# EAGLE design KeyboardLight (EAGLE 5.09)
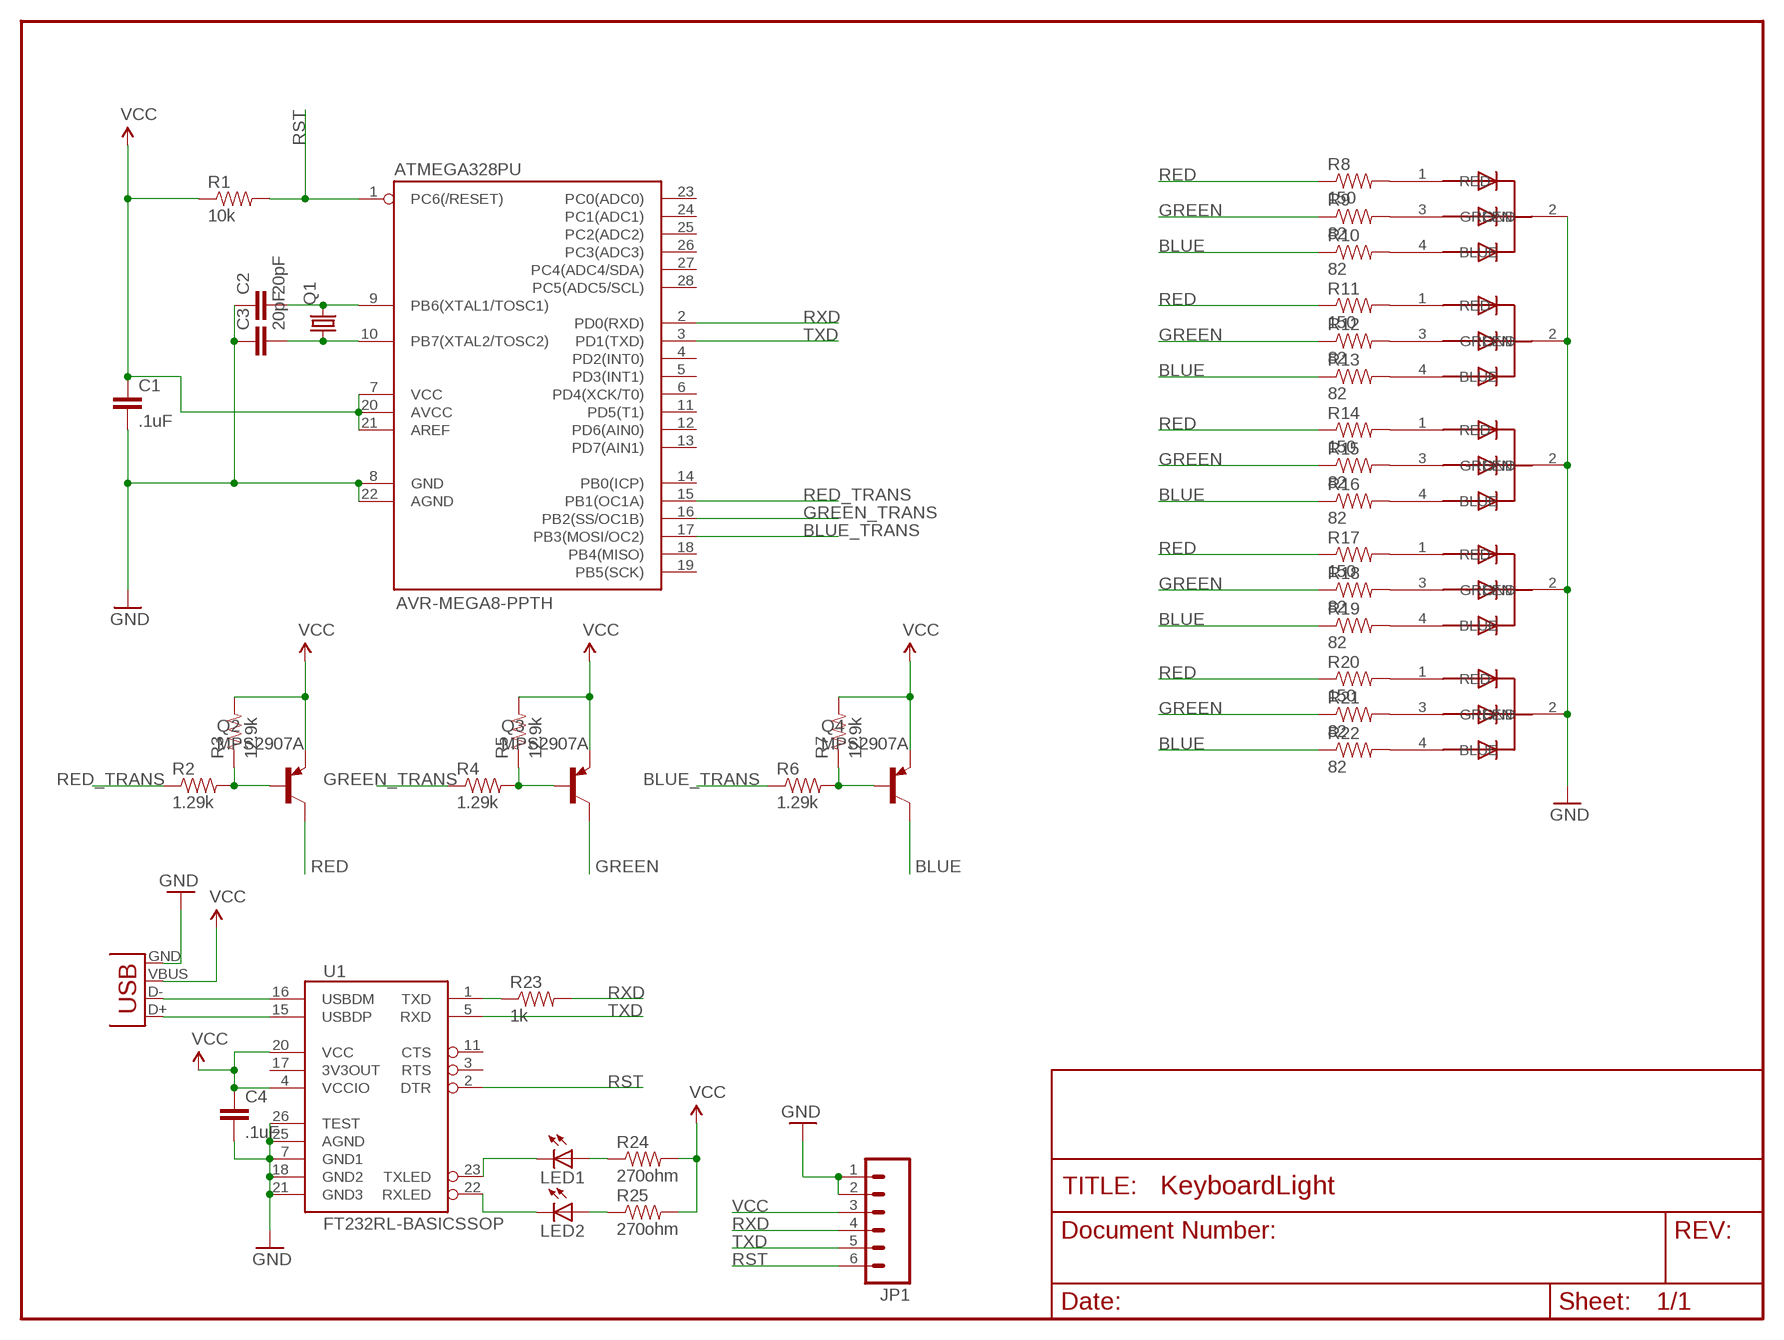
[diagram p0: schematic, sheet 1]

## Parts
ATMEGA328PU  AVR-MEGA8-PPTH  [DIL28-3]
C1  .1uF  CAPPTH  [CAP-PTH-SMALL]
C2  20pF  CAPPTH  [CAP-PTH-SMALL]
C3  20pF  CAPPTH  [CAP-PTH-SMALL]
C4  .1uF  CAPPTH  [CAP-PTH-SMALL]
JP1  M06LONGPADS  [1X06_LONGPADS]
LED1  LED0603  [LED-0603]
LED2  LED0603  [LED-0603]
Q1  CRYSTALHC49UV  [HC49U-V]
Q2  MPS2907A  [TO92-CBE]
Q3  MPS2907A  [TO92-CBE]
Q4  MPS2907A  [TO92-CBE]
R1  10k  RESISTORPTH1  [AXIAL-0.3]
R2  1.29k  RESISTORPTH1  [AXIAL-0.3]
R3  12.9k  RESISTORPTH1  [AXIAL-0.3]
R4  1.29k  RESISTORPTH1  [AXIAL-0.3]
R5  12.9k  RESISTORPTH1  [AXIAL-0.3]
R6  1.29k  RESISTORPTH1  [AXIAL-0.3]
R7  12.9k  RESISTORPTH1  [AXIAL-0.3]
R8  150  RESISTORPTH1  [AXIAL-0.3]
R9  82  RESISTORPTH1  [AXIAL-0.3]
R10  82  RESISTORPTH1  [AXIAL-0.3]
R11  150  RESISTORPTH1  [AXIAL-0.3]
R12  82  RESISTORPTH1  [AXIAL-0.3]
R13  82  RESISTORPTH1  [AXIAL-0.3]
R14  150  RESISTORPTH1  [AXIAL-0.3]
R15  82  RESISTORPTH1  [AXIAL-0.3]
R16  82  RESISTORPTH1  [AXIAL-0.3]
R17  150  RESISTORPTH1  [AXIAL-0.3]
R18  82  RESISTORPTH1  [AXIAL-0.3]
R19  82  RESISTORPTH1  [AXIAL-0.3]
R20  150  RESISTORPTH1  [AXIAL-0.3]
R21  82  RESISTORPTH1  [AXIAL-0.3]
R22  82  RESISTORPTH1  [AXIAL-0.3]
R23  1k  RESISTORPTH1  [AXIAL-0.3]
R24  270ohm  RESISTORPTH1  [AXIAL-0.3]
R25  270ohm  RESISTORPTH1  [AXIAL-0.3]
U1  FT232RL-BASICSSOP  [SSOP28DB]
U$1  RGBLED5MM_CC  [LEDRGB5MM]
U$2  RGBLED5MM_CC  [LEDRGB5MM]
U$3  RGBLED5MM_CC  [LEDRGB5MM]
U$4  RGBLED5MM_CC  [LEDRGB5MM]
U$5  RGBLED5MM_CC  [LEDRGB5MM]
U$6  MOTTO  [BECURIOUSMYSON]
X1  USBPTH  [USB-B-PTH]

## Nets
BLUE: Q4.C R10.P$1 R13.P$1 R16.P$1 R19.P$1 R22.P$1
BLUE_TRANS: ATMEGA328PU.17(PB3(MOSI/OC2)) R6.P$1
GND: ATMEGA328PU.8(GND) ATMEGA328PU.22(AGND) C1.2 C2.1 C3.1 C4.2 JP1.1 JP1.2 U1.7(GND1) U1.18(GND2) U1.21(GND3) U1.25(AGND) U1.26(TEST) U$1.2(GND) U$2.2(GND) U$3.2(GND) U$4.2(GND) U$5.2(GND) X1.GND
GREEN: Q3.C R9.P$1 R12.P$1 R15.P$1 R18.P$1 R21.P$1
GREEN_TRANS: ATMEGA328PU.16(PB2(SS/OC1B)) R4.P$1
N$1: ATMEGA328PU.9(PB6(XTAL1/TOSC1)) C2.2 Q1.2
N$2: ATMEGA328PU.10(PB7(XTAL2/TOSC2)) C3.2 Q1.1
N$3: U1.16(USBDM) X1.D-
N$4: Q2.B R2.P$2 R3.P$1
N$5: Q3.B R4.P$2 R5.P$1
N$6: Q4.B R6.P$2 R7.P$1
N$7: R8.P$2 U$1.1(RED)
N$8: R9.P$2 U$1.3(GREEN)
N$9: R10.P$2 U$1.4(BLUE)
N$10: R11.P$2 U$2.1(RED)
N$11: R12.P$2 U$2.3(GREEN)
N$12: R13.P$2 U$2.4(BLUE)
N$13: R14.P$2 U$3.1(RED)
N$14: R15.P$2 U$3.3(GREEN)
N$15: R16.P$2 U$3.4(BLUE)
N$16: R17.P$2 U$4.1(RED)
N$17: R18.P$2 U$4.3(GREEN)
N$18: R19.P$2 U$4.4(BLUE)
N$19: R20.P$2 U$5.1(RED)
N$20: R21.P$2 U$5.3(GREEN)
N$21: R22.P$2 U$5.4(BLUE)
N$22: U1.15(USBDP) X1.D+
N$23: LED1.A R24.P$1
N$24: R23.P$1 U1.1(TXD)
N$25: LED2.A R25.P$1
N$26: LED1.C U1.23(TXLED)
N$27: LED2.C U1.22(RXLED)
RED: Q2.C R8.P$1 R11.P$1 R14.P$1 R17.P$1 R20.P$1
RED_TRANS: ATMEGA328PU.15(PB1(OC1A)) R2.P$1
RST: ATMEGA328PU.1(PC6(/RESET)) JP1.6 R1.P$2 U1.2(DTR)
RXD: ATMEGA328PU.2(PD0(RXD)) JP1.4 R23.P$2
TXD: ATMEGA328PU.3(PD1(TXD)) JP1.5 U1.5(RXD)
VCC: ATMEGA328PU.7(VCC) ATMEGA328PU.20(AVCC) ATMEGA328PU.21(AREF) C1.1 C4.1 JP1.3 Q2.E Q3.E Q4.E R1.P$1 R3.P$2 R5.P$2 R7.P$2 R24.P$2 R25.P$2 U1.4(VCCIO) U1.20(VCC) X1.VBUS
Unconnected: ATMEGA328PU.4(PD2(INT0)) ATMEGA328PU.5(PD3(INT1)) ATMEGA328PU.6(PD4(XCK/T0)) ATMEGA328PU.11(PD5(T1)) ATMEGA328PU.12(PD6(AIN0)) ATMEGA328PU.13(PD7(AIN1)) ATMEGA328PU.14(PB0(ICP)) ATMEGA328PU.18(PB4(MISO)) ATMEGA328PU.19(PB5(SCK)) ATMEGA328PU.23(PC0(ADC0)) ATMEGA328PU.24(PC1(ADC1)) ATMEGA328PU.25(PC2(ADC2)) ATMEGA328PU.26(PC3(ADC3)) ATMEGA328PU.27(PC4(ADC4/SDA)) ATMEGA328PU.28(PC5(ADC5/SCL)) U1.3(RTS) U1.11(CTS) U1.17(3V3OUT)

## Library data of the parts
ATMEGA328PU = SparkFun:AVR-MEGA8-P: MICROCONTROLLER 8 Kbytes FLASH 1 kbytes SRAM 512 bytes EEPROM USART 4-channel 10 bit ADC 2-channel 8 bit ADC
C1-C4 = SparkFun:CAP: Capacitor Standard 0603 ceramic capacitor, and 0.1" leaded capacitor.
JP1 = SparkFun:M06: Header 6 Standard 6-pin 0.1" header. Use with straight break away headers (SKU : PRT-00116), right angle break away headers (PRT-00553), swiss pins (PRT-00743), machine pins (PRT-00117), and female headers (PRT-00115). Molex polarized connector foot print use with SKU : PRT-08094 with associated crimp pins and housings. NOTES ON THE VARIANTS LOCK and LOCK_LONGPADS... This footprint was designed to help hold the alignment of a through-hole component (i.e. 6-pin header) while soldering it into place. You may notice that each hole has been shifted either up or down by 0.005 of an inch from it's more standard position (which is a perfectly straight line). This slight alteration caused the pins (the squares in the middle) to touch the edges of the holes. Because they are alternating, it causes a "brace" to hold the component in place. 0.005 has proven to be the perfect amount of "off-center" position when using our standard breakaway headers. Although looks a little odd when you look at the bare footprint, once you have a header in there, the alteration is very hard to notice. Also, if you push a header all the way into place, it is covered up entirely on the bottom side. This idea of altering the position of holes to aid alignment will be further integrated into the Sparkfun Library for other footprints. It can help hold any component with 3 or more connection pins.
LED1 LED2 = SparkFun:LED: LEDs Standard schematic elements and footprints for 5mm, 3mm, 1206, and 0603 sized LEDs. 5mm - Spark Fun Electronics SKU : COM-00529 (and others)
Q1 = SparkFun:CRYSTAL: Crystals Various standard crystals. Proven footprints. Spark Fun Electronics SKU : COM-00534
Q2-Q4 = transistor-pnp:MPS2907*: PNP Transistror
R1-R25 = SparkFun:RESISTOR: Resistor Basic schematic elements and footprints for 0603, 1206, and PTH 1/10th watt (small) resistors.
U1 = SparkFun:FT232RL-BASIC: USB UART This is the simplified version of the FT232RL unit. Only what you need, nothing you don't. Spark Fun Electronics SKU : COM-00650
U$1-U$5 = jaycollett:RGBLED5MM_CC: 5MM RGB LED Common Cathode Suggested 150ohm for RED and 82ohm for Green and Blue
U$6 = jaycollett:MOTTO
X1 = SparkFun:USB: USB Connectors USB-B-PTH is fully proven SKU : PRT-00139 USB-miniB is fully proven SKU : PRT-00587 USB-A-PCB is untested. USB-A-H is throughly reviewed, but untested. Spark Fun Electronics SKU : PRT-00437 USB-B-SMT is throughly reviewed, but untested. Needs silkscreen touching up. USB-A-S has not been used/tested USB-MB-H has not been used/tested

## Board
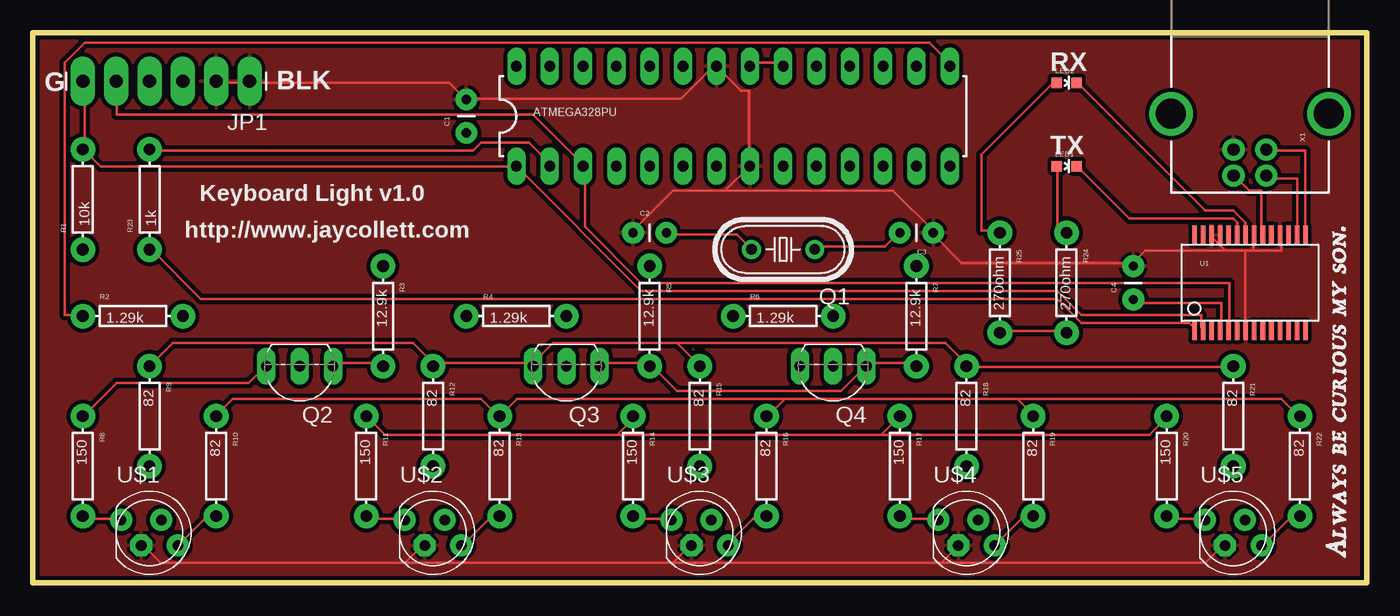
[diagram p1: board, top side]
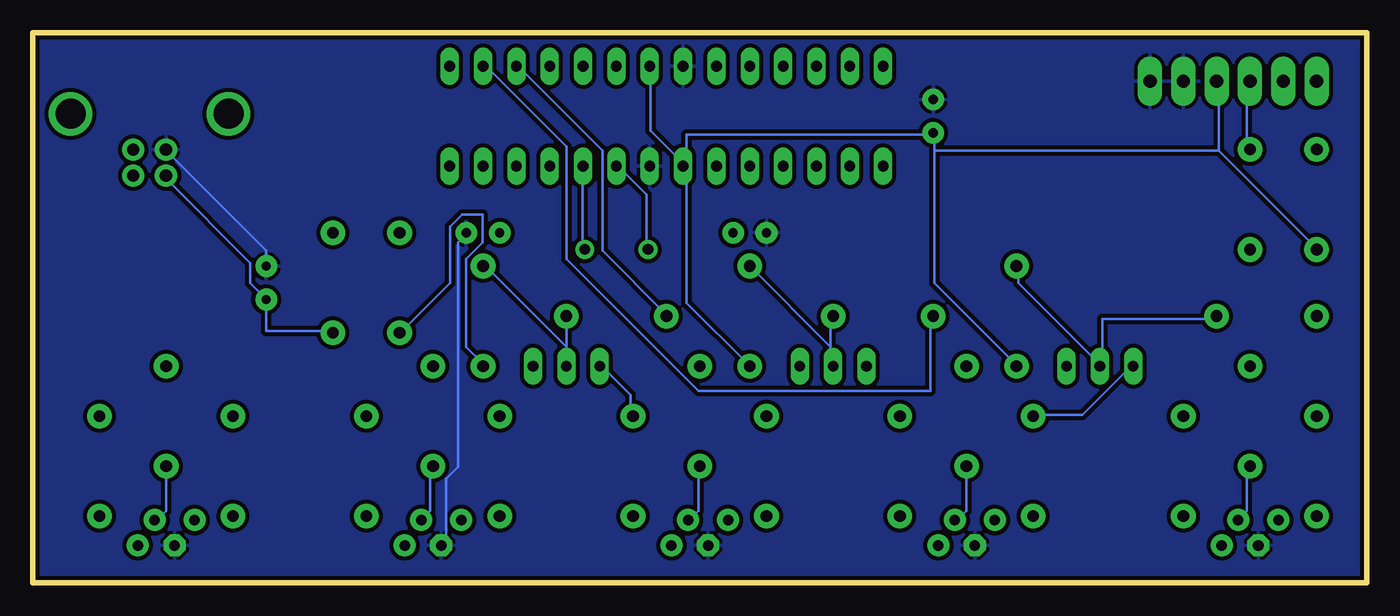
[diagram p2: board, bottom side, seen from below]

Size 101.6 x 41.91 mm. Coordinates in mm from the lower left corner, seen from the top.
Outline: 0,0 101.6,0 101.6,41.91 0,41.91 0,0
Copper layers (1*16): Top 0.035mm / dielectric 1.5mm / Bottom 0.035mm
Design rules "SparkFun": minimum track width 8mil, minimum drill 20mil, track to track 8mil, track to pad 8mil, pad to pad 8mil, via to via 8mil, smd to smd 8mil, copper to edge 10mil, drill to drill 8mil, minimum pad ring 12mil, minimum via ring 10mil, stop-mask expansion 4mil, vias tented up to drill 25mil, thermal gap 10mil

### Footprints (pad centres in the part's own frame; a part is rotated, then mirrored left to right if it is on the bottom)
DIL28-3 = drill 0.813 long: 1 -16.51,-3.81; 2 -13.97,-3.81; 3 -11.43,-3.81; 4 -8.89,-3.81; 5 -6.35,-3.81; 6 -3.81,-3.81; 7 -1.27,-3.81; 8 1.27,-3.81; 9 3.81,-3.81; 10 6.35,-3.81; 11 8.89,-3.81; 12 11.43,-3.81; 13 13.97,-3.81; 14 16.51,-3.81; 15 16.51,3.81; 16 13.97,3.81; 17 11.43,3.81; 18 8.89,3.81; 19 6.35,3.81; 20 3.81,3.81; 21 1.27,3.81; 22 -1.27,3.81; 23 -3.81,3.81; 24 -6.35,3.81; 25 -8.89,3.81; 26 -11.43,3.81; 27 -13.97,3.81; 28 -16.51,3.81
CAP-PTH-SMALL = drill 0.7 pad 1.651 round: 1 0,0; 2 2.54,0
1X06_LONGPADS = drill 1.016 pad 1.88 long: 1 0,0; 2 2.54,0; 3 5.08,0; 4 7.62,0; 5 10.16,0; 6 12.7,0
LED-0603 = smd 0.8 x 0.8: A 0,-0.75; C 0,0.75
HC49U-V = drill 0.813 round: 1 -2.413,0; 2 2.413,0
TO92-CBE = drill 0.813 long: B 0,0; C 2.54,0; E -2.54,0
AXIAL-0.3 = drill 0.9 pad 1.88 round: P$1 -3.81,0; P$2 3.81,0
SSOP28DB = smd 0.348 x 1.397: 1 -4.225,-3.656; 2 -3.575,-3.656; 3 -2.925,-3.656; 4 -2.275,-3.656; 5 -1.625,-3.656; 6 -0.975,-3.656; 7 -0.325,-3.656; 8 0.325,-3.656; 9 0.975,-3.656; 10 1.625,-3.656; 11 2.275,-3.656; 12 2.925,-3.656; 13 3.575,-3.656; 14 4.225,-3.656; 15 4.225,3.656; 16 3.575,3.656; 17 2.925,3.656; 18 2.275,3.656; 19 1.625,3.656; 20 0.975,3.656; 21 0.325,3.656; 22 -0.325,3.656; 23 -0.975,3.656; 24 -1.625,3.656; 25 -2.275,3.656; 26 -2.925,3.656; 27 -3.575,3.656; 28 -4.225,3.656
LEDRGB5MM = drill 0.8 pad 1.676 round: 1 -2.159,0.968; 3 0.889,0.968; 4 2.159,-0.968 | drill 0.8 pad 1.676 octagon: 2 -0.635,-0.968
USB-B-PTH = drill 0.914 pad 1.676 round: D+ 0,1.25; D- 1.981,1.25; GND 0,-1.25; VBUS 1.981,-1.25 | drill 2.286 round: P$1 -2.718,-6.02; P$2 -2.718,6.02

### Placement (x,y rotation side)
ATMEGA328PU  53.34,35.56 0 top
C1  33.02,34.29 90 top
C2  45.72,26.67 0 top
C3  68.58,26.67 180 top
C4  83.82,21.59 90 top
JP1  16.51,38.23 180 top
LED1  78.74,31.75 270 top
LED2  78.74,38.1 270 top
Q1  57.15,25.4 180 top
Q2  20.32,16.51 180 top
Q3  40.64,16.51 180 top
Q4  60.96,16.51 180 top
R1  3.81,29.21 90 top
R2  7.62,20.32 0 top
R3  26.67,20.32 270 top
R4  36.83,20.32 0 top
R5  46.99,20.32 270 top
R6  57.15,20.32 0 top
R7  67.31,20.32 270 top
R8  3.81,8.89 270 top
R9  8.89,12.7 270 top
R10  13.97,8.89 270 top
R11  25.4,8.89 270 top
R12  30.48,12.7 270 top
R13  35.56,8.89 270 top
R14  45.72,8.89 270 top
R15  50.8,12.7 270 top
R16  55.88,8.89 270 top
R17  66.04,8.89 270 top
R18  71.12,12.7 270 top
R19  76.2,8.89 270 top
R20  86.36,8.89 270 top
R21  91.44,12.7 270 top
R22  96.52,8.89 270 top
R23  8.89,29.21 90 top
R24  78.74,22.86 270 top
R25  73.66,22.86 270 top
U1  92.71,22.86 0 top
U$1  8.89,3.81 0 top
U$2  30.48,3.81 0 top
U$3  50.8,3.81 0 top
U$4  71.12,3.81 0 top
U$5  91.44,3.81 0 top
U$6  100.46,1.91 90 top
X1  92.71,33.02 270 top

### Tracks (layer width: path | path; a pad name or v marks a point on that pad's centre or on a via)
BLUE
  Top 0.203: R10.P$1 14.02,12.8 15.24,14.02 34.14,14.02 35.36,12.8 R13.P$1 36.88,14.02 57.3,14.02 | 74.98,14.02 76.2,12.8 R19.P$1 | 57.3,14.02 74.98,14.02 | 57.3,14.02 56.08,12.8 R16.P$1 | 74.98,14.02 95.1,14.02 96.32,12.8 R22.P$1
  Bottom 0.203: Q4.C 58.22,16.46 56.08,14.33 56.08,12.8 R16.P$1
BLUE_TRANS
  Bottom 0.203: ATMEGA328PU.17 64.62,39.32 58.22,32.92 58.22,25.3 53.34,20.42 R6.P$1
GND
  Top 0.203: 28.35,1.52 9.75,1.52 8.53,2.74 U$1.2 | 28.35,1.52 29.57,2.74 U$2.2 | 48.77,1.52 49.99,2.74 U$3.2 | 28.35,1.52 48.77,1.52 | 69.19,1.52 70.41,2.74 U$4.2 | 48.77,1.52 69.19,1.52 | 69.19,1.52 89.31,1.52 90.53,2.74 U$5.2 | 92.35,25.3 92.35,19.51 U1.7 | 90.83,25.3 92.35,25.3 | 90.22,25.91 89.92,26.21 U1.26 | 90.83,25.3 90.22,25.91 | 90.22,25.91 90.53,26.21 U1.25 | 92.96,25.3 92.96,26.21 U1.21 | 92.35,25.3 92.96,25.3 | 92.96,25.3 95.1,25.3 95.1,26.21 U1.18 | 83.82,24.38 84.73,25.3 90.83,25.3 | 83.82,24.38 70.71,24.38 68.58,26.52 C3.1 68.58,26.82 65.53,29.87 52.73,29.87 | 83.82,24.38 C4.2 | 52.73,29.87 48.77,29.87 45.72,26.82 C2.1 | 52.73,29.87 ATMEGA328PU.8 54.56,32 54.56,37.49 53.95,37.49 ATMEGA328PU.22 51.82,39.32 49.38,36.88 33.22,36.88 C1.2 32.92,36.88 31.7,38.1 16.76,38.1 JP1.1 16.46,38.1 14.02,38.1 JP1.2
  Bottom 0.203: X1.GND 91.44,32.92 83.82,25.3 C4.2 | U$4.2 70.41,3.05 70.1,3.35 70.1,7.92 69.19,8.84 69.19,25.91 68.58,26.52 C3.1
  pour Top (isolate 0.305): 50.8,28.57 50.8,22.1 63.5,22.1 63.5,28.57
  pour Bottom (isolate 0.305): 50.8,28.57 50.8,22.1 63.5,22.1 63.5,28.57
  pour Top (isolate 0.305): 0,41.91 0,0 101.6,0 101.6,41.91 1.27,41.91
  pour Bottom (isolate 0.305): 0,41.91 0,0 101.6,0 101.6,41.91
GREEN
  Top 0.203: R21.P$1 91.44,16.46 71.32,16.46 R18.P$1 71.02,16.76 69.49,18.29 49.07,18.29 | 30.48,16.76 38.1,16.76 | 30.48,16.76 28.96,18.29 10.67,18.29 R9.P$1 | 30.48,16.76 R12.P$1 | 49.07,18.29 50.6,16.76 R15.P$1 | 49.07,18.29 39.62,18.29 38.1,16.76 | 38.1,16.76 Q3.C
GREEN_TRANS
  Bottom 0.203: ATMEGA328PU.16 67.06,39.32 60.96,33.22 60.96,24.69 50.9,14.63 33.22,14.63 33.22,20.12 R4.P$1
N$1
  Top 0.203: Q1.2 54.56,25.6 53.65,26.52 48.46,26.52 C2.2
  Bottom 0.203: ATMEGA328PU.9 57,31.7 54.86,29.57 54.86,25.6 Q1.2
N$2
  Top 0.203: C3.2 65.84,26.52 64.92,25.6 59.74,25.6 Q1.1
  Bottom 0.203: Q1.1 59.74,25.6 59.74,31.7 ATMEGA328PU.10
N$3
  Top 0.203: U1.16 96.32,26.52 96.32,30.79 94.18,30.79 X1.D-
N$4
  Bottom 0.203: R3.P$1 26.52,24.08 26.52,22.86 20.42,16.76 Q2.B 20.12,16.76 20.12,20.12 11.58,20.12 R2.P$2
N$5
  Bottom 0.203: 40.84,17.98 40.84,20.12 R4.P$2 | 40.84,17.98 40.84,16.76 Q3.B | 40.84,17.98 R5.P$1
N$6
  Bottom 0.203: Q4.B 60.96,17.98 | 60.96,17.98 R6.P$2 | 60.96,17.98 67.06,24.08 R7.P$1
N$7
  Top 0.203: U$1.1 6.71,4.88 3.96,4.88 R8.P$2
N$8
  Bottom 0.203: U$1.3 9.75,4.88 9.14,5.49 9.14,8.84 R9.P$2
N$9
  Top 0.203: U$1.4 11.28,3.05 13.11,4.88 13.72,4.88 R10.P$2
N$10
  Top 0.203: U$2.1 28.04,4.88 25.6,4.88 R11.P$2
N$11
  Bottom 0.203: U$2.3 31.09,4.88 30.48,5.49 R12.P$2
N$12
  Top 0.203: U$2.4 32.92,3.05 34.75,4.88 35.36,4.88 R13.P$2
N$13
  Top 0.203: U$3.1 48.46,4.88 45.72,4.88 R14.P$2
N$14
  Bottom 0.203: U$3.3 51.51,4.88 50.9,5.49 50.9,8.84 R15.P$2
N$15
  Top 0.203: U$3.4 53.03,3.05 54.86,4.88 55.78,4.88 R16.P$2
N$16
  Top 0.203: U$4.1 68.89,4.88 66.14,4.88 R17.P$2
N$17
  Bottom 0.203: U$4.3 71.93,4.88 71.32,5.49 71.32,8.84 R18.P$2
N$18
  Top 0.203: U$4.4 73.46,3.05 75.29,4.88 76.2,4.88 R19.P$2
N$19
  Top 0.203: U$5.1 89,4.88 86.56,4.88 R20.P$2
N$20
  Bottom 0.203: U$5.3 92.05,4.88 91.44,5.49 R21.P$2
N$21
  Top 0.203: U$5.4 93.88,3.05 95.71,4.88 96.32,4.88 R22.P$2
N$22
  Top 0.203: U1.15 96.93,32.92 94.18,32.92 X1.D+
N$23
  Top 0.203: LED1.A 78.03,31.7 78.03,26.82 78.64,26.82 R24.P$1
N$24
  Top 0.203: U1.1 88.39,19.51 88.09,19.81 79.86,19.81 78.03,21.64 12.8,21.64 9.14,25.3 R23.P$1
N$25
  Top 0.203: LED2.A 77.72,38.1 72.24,32.61 72.24,26.82 73.46,26.82 R25.P$1
N$26
  Top 0.203: LED1.C 79.55,31.7 83.52,27.74 91.44,27.74 91.75,27.43 91.75,26.52 U1.23
N$27
  Top 0.203: LED2.C 79.55,38.1 89.31,28.35 91.44,28.35 92.35,27.43 92.35,26.52 U1.22
RED
  Top 0.203: R8.P$1 3.96,12.8 6.4,15.24 16.46,15.24 17.68,16.46 Q2.C | 44.5,11.28 45.72,12.5 R14.P$1 | 44.5,11.28 26.82,11.28 R11.P$1 | 44.5,11.28 64.62,11.28 | 64.62,11.28 R17.P$1 | 64.62,11.28 85.04,11.28 86.26,12.5 R20.P$1
  Bottom 0.203: Q2.C 17.98,16.46 21.64,12.8 25.3,12.8 R11.P$1
RED_TRANS
  Top 0.203: ATMEGA328PU.15 69.8,39.62 68.28,41.15 3.96,41.15 2.44,39.62 2.44,20.42 3.66,20.42 R2.P$1
RST
  Top 0.203: JP1.6 3.96,38.1 3.96,33.22 R1.P$2 3.96,32.92 5.18,31.7 36.58,31.7 ATMEGA328PU.1 46.33,22.25 78.03,22.25 79.86,20.42 89,20.42 89,19.51 U1.2
RXD
  Top 0.203: ATMEGA328PU.2 39.32,32 37.8,33.53 34.14,33.53 33.53,32.92 9.14,32.92 R23.P$2
  Bottom 0.203: JP1.4 9.14,38.1 9.14,33.22 R23.P$2
TXD
  Top 0.203: U1.5 91.14,19.51 91.14,22.86 46.33,22.86 42.06,27.13 42.06,31.7 ATMEGA328PU.3 41.76,32 38.1,35.66 6.4,35.66 6.4,38.1 JP1.5
VCC
  Top 0.203: R25.P$2 73.76,19.2 78.64,19.2 R24.P$2 | U1.20 93.57,26.52 93.57,29.87 92.66,29.87 91.75,30.79 X1.VBUS | U1.4 90.53,19.51 90.53,21.34 83.82,21.34 C4.1 | R7.P$2 67.06,16.76 63.7,16.76 Q4.E 63.4,16.46 61.57,14.63 49.07,14.63 47.24,16.46 R5.P$2 46.94,16.76 43.28,16.76 Q3.E | Q2.E 22.86,16.76 26.52,16.76 R3.P$2 | ATMEGA328PU.20 57,39.62 54.86,39.62 ATMEGA328PU.21
  Bottom 0.203: X1.VBUS 91.44,30.79 85.04,24.38 85.04,22.86 83.82,21.64 C4.1 83.82,19.2 78.94,19.2 R24.P$2 | 11.28,32.92 3.96,25.6 R1.P$1 | 11.28,32.92 11.28,38.1 JP1.3 | ATMEGA328PU.7 52.12,32 54.56,34.44 54.56,39.32 ATMEGA328PU.21 | ATMEGA328PU.7 51.82,32 51.82,34.14 33.22,34.14 C1.1 32.92,34.14 32.92,32.92 | 32.92,32.92 32.92,22.86 26.82,16.76 R3.P$2 | R5.P$2 51.82,21.34 51.82,31.7 ATMEGA328PU.7 | 11.28,32.92 32.92,32.92 | R25.P$2 73.46,19.2 69.8,22.86 69.8,27.13 68.89,28.04 67.36,28.04 67.36,25.91 68.58,24.69 68.58,17.98 67.36,16.76 R7.P$2

### Text on the board
tPlace: RX | BLK | G | TX | Keyboard Light v1.0 | http://www.jaycollett.com